# Altium schematic sheet STM32_microcontroller_power.SchDoc: STM32_microcontroller_power
size A4; SheetNumber: 4; SheetTotal: 8
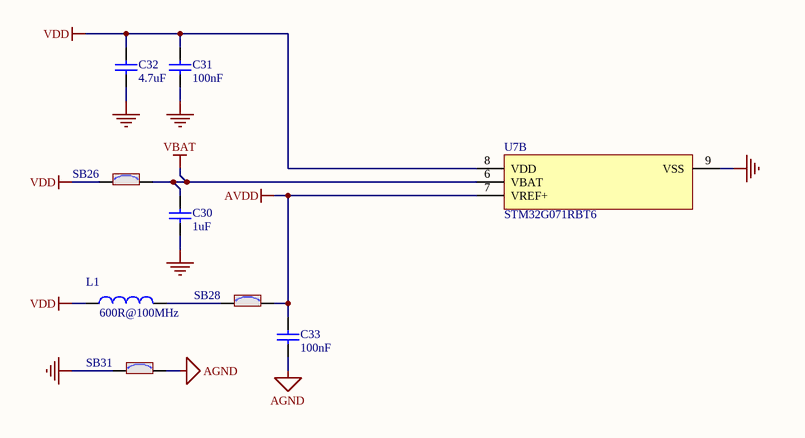
[diagram p0: STM32_microcontroller_power.SchDoc]

## Parts
C30  value 1uF  [C0603]  (hidden comment: Capacitor)
C31  value 100nF  [C0603]  (hidden comment: Capacitor)
C32  value 4.7uF  [C0603]  (hidden comment: Capacitor)
C33  value 100nF  [C0603]  (hidden comment: Capacitor)
L1  value 600R@100MHz  [L0603]  (hidden comment: BEAD)
SB26  SB_ON  [SOLDER-BRIDGE_R0603-0R]  (value not drawn)
SB28  SB_ON  [SOLDER-BRIDGE_R0603-0R]  (value not drawn)
SB31  SB_ON  [SOLDER-BRIDGE_R0603-0R]  (value not drawn)
U7  STM32G071RBT6  [ICC_LQFP64_10X10_P050_SOCKET_YAMAICHI_IC149-064-069-B5]  (part B of 2)

## Nets
AGND: C33.1 SB31.2
AVDD: C33.2 SB28.2 U7.7(VREF+)
GND: C30.1 C31.1 C32.1 SB31.1 U7.9(VSS)
VBAT: C30.2 SB26.2 U7.6(VBAT)
VDD: C31.2 C32.2 L1.1 SB26.1 U7.8(VDD)
NetL1_2: L1.2 SB28.1

## Notes on the sheet
- Title:
- Project:
- Size:
- Revision:
- Variant:
- A4
- -
- Date:
- Reference:
- Sheet:
- of

## Library data of the parts
C30 = MCD-00010: Capacitor, MLCC, 1uF, 16V, X5R, 10%, 0603, T=0,8mm; Manufacturer_Part_Number: CC0603KRX5R7BB105; Manufacturer: YAGEO; ECCN_US: EAR99; ECCN_EU: NEC; Provided_By: SUBCO; Internal_Part_Number: MCD-00010; Status: Released; Part_Type: Capacitor; Package: C0603; ComponentLink1Description: Datasheet; ComponentLink1URL: http://tunmcdsvn.tun.st.com/Component_Datasheet_Library/Trunk/Capacitors/Yageo_Multilayer_capacitor_X5R_series_100pF_to_100uF
C31 C33 = MCD-00211: Capacitor, MLCC, 100nF, 16V, X7R, 10%, 0603, T=0,8mm; Manufacturer_Part_Number: CC0603KRX7R7BB104; Manufacturer: YAGEO; ECCN_US: EAR99; ECCN_EU: NEC; Provided_By: SUBCO; Internal_Part_Number: MCD-00211; Status: Released; Part_Type: Capacitor; Package: C0603; ComponentLink1Description: Datasheet; ComponentLink1URL: http://tunmcdsvn.tun.st.com/Component_Datasheet_Library/Trunk/Capacitors/Yageo_Multilayer_Capacitor_X7R_series_100pF_to_22uF
C32 = MCD-00009: Capacitor, MLCC, 4.7uF, 16V, X5R, 10%, 0603, T=0.8mm; Manufacturer_Part_Number: CC0603KRX5R7BB475; Manufacturer: YAGEO; ECCN_US: EAR99; ECCN_EU: NEC; Provided_By: SUBCO; Internal_Part_Number: MCD-00009; Status: Released; Part_Type: Capacitor; Package: C0603; ComponentLink1Description: Datasheet; ComponentLink1URL: http://tunmcdsvn.tun.st.com/Component_Datasheet_Library/Trunk/Capacitors/Yageo_Multilayer_capacitor_X5R_series_100pF_to_100uF
L1 = MCD-00047: SMD Chip ferrite bead, 600R@100MHz +/-25%, 350mA, 500mohm DC, 0603, T=0.8mm; Manufacturer_Part_Number: FCM1608KF-601T03; Manufacturer: TAI-TECH; Part_Type: Inductor; Provided_By: SUBCO; Internal_Part_Number: MCD-00047; ECCN_US: n/a; ECCN_EU: n/a; ComponentLink1Description: Datasheet; Status: Released; ComponentLink1URL: http://tunmcdsvn.tun.st.com/Component_Datasheet_Library/Trunk/Inductors/TaiTech_Bead_FCM1608_series
SB26 SB28 SB31 = MCD-00071: Solder Bridge ON; Part_Type: Mechanical; Manufacturer_Part_Number: RC0603JR-070RL; Manufacturer: YAGEO; Provided_By: SUBCO; Internal_Part_Number: MCD-00071; ECCN_US: n/a; ECCN_EU: n/a; Status: Released; Package: SB0603; ComponentLink1Description: Datasheet; ComponentLink1URL: http://tunmcdsvn.tun.st.com/Component_Datasheet_Library/Trunk/Resistors/Yageo_Resistor_RC0603-series
U7 = MCD-00662: Medium-density performance line ARM-based 32-bit MCU with 128KB Flash. LQFP64 IC149-064-069-B5 socket footprint.; Part_Type: IC; Manufacturer: STMICROELECTRONICS; BMS_Part_Number: 9175318; ECCN_US: 3A991A2; ECCN_EU: NEC; Provided_By: SUBCO with ST control; Internal_Part_Number: MCD-00662; Value: STM32G071RBT6; Status: Checked; Manufacturer_Part_Number: STM32G071RBT6; Package: LQFP64 IC149-064-069-B5 socket; ComponentLink1Description: Datasheet; ComponentLink1URL: http://tunmcdsvn.tun.st.com/Component_Datasheet_Library/Trunk/IC/STM_POA_ LQFP 10x10 64L